# EasyEDA Pro project ProPrj_宠物喂养自动控制系统_2026-04-17.epro

# Schematic Schematic1
Assembly Variant: Basic; Board Name: Board1; Create Date: 2026-04-10; Page Name: P1; Project Name: 宠物喂养自动控制系统; Schematic Name: Schematic1; Update Date: 2026-04-10; BladeWidth: 10; Company: 嘉立创EDA; Page Size: A4; RegionStart: 1; ShowBorder: 1; TitleBlock: 1; TitleBlockPosition: 3; Version: V1.0; XRegionCount: 6; YRegionCount: 4
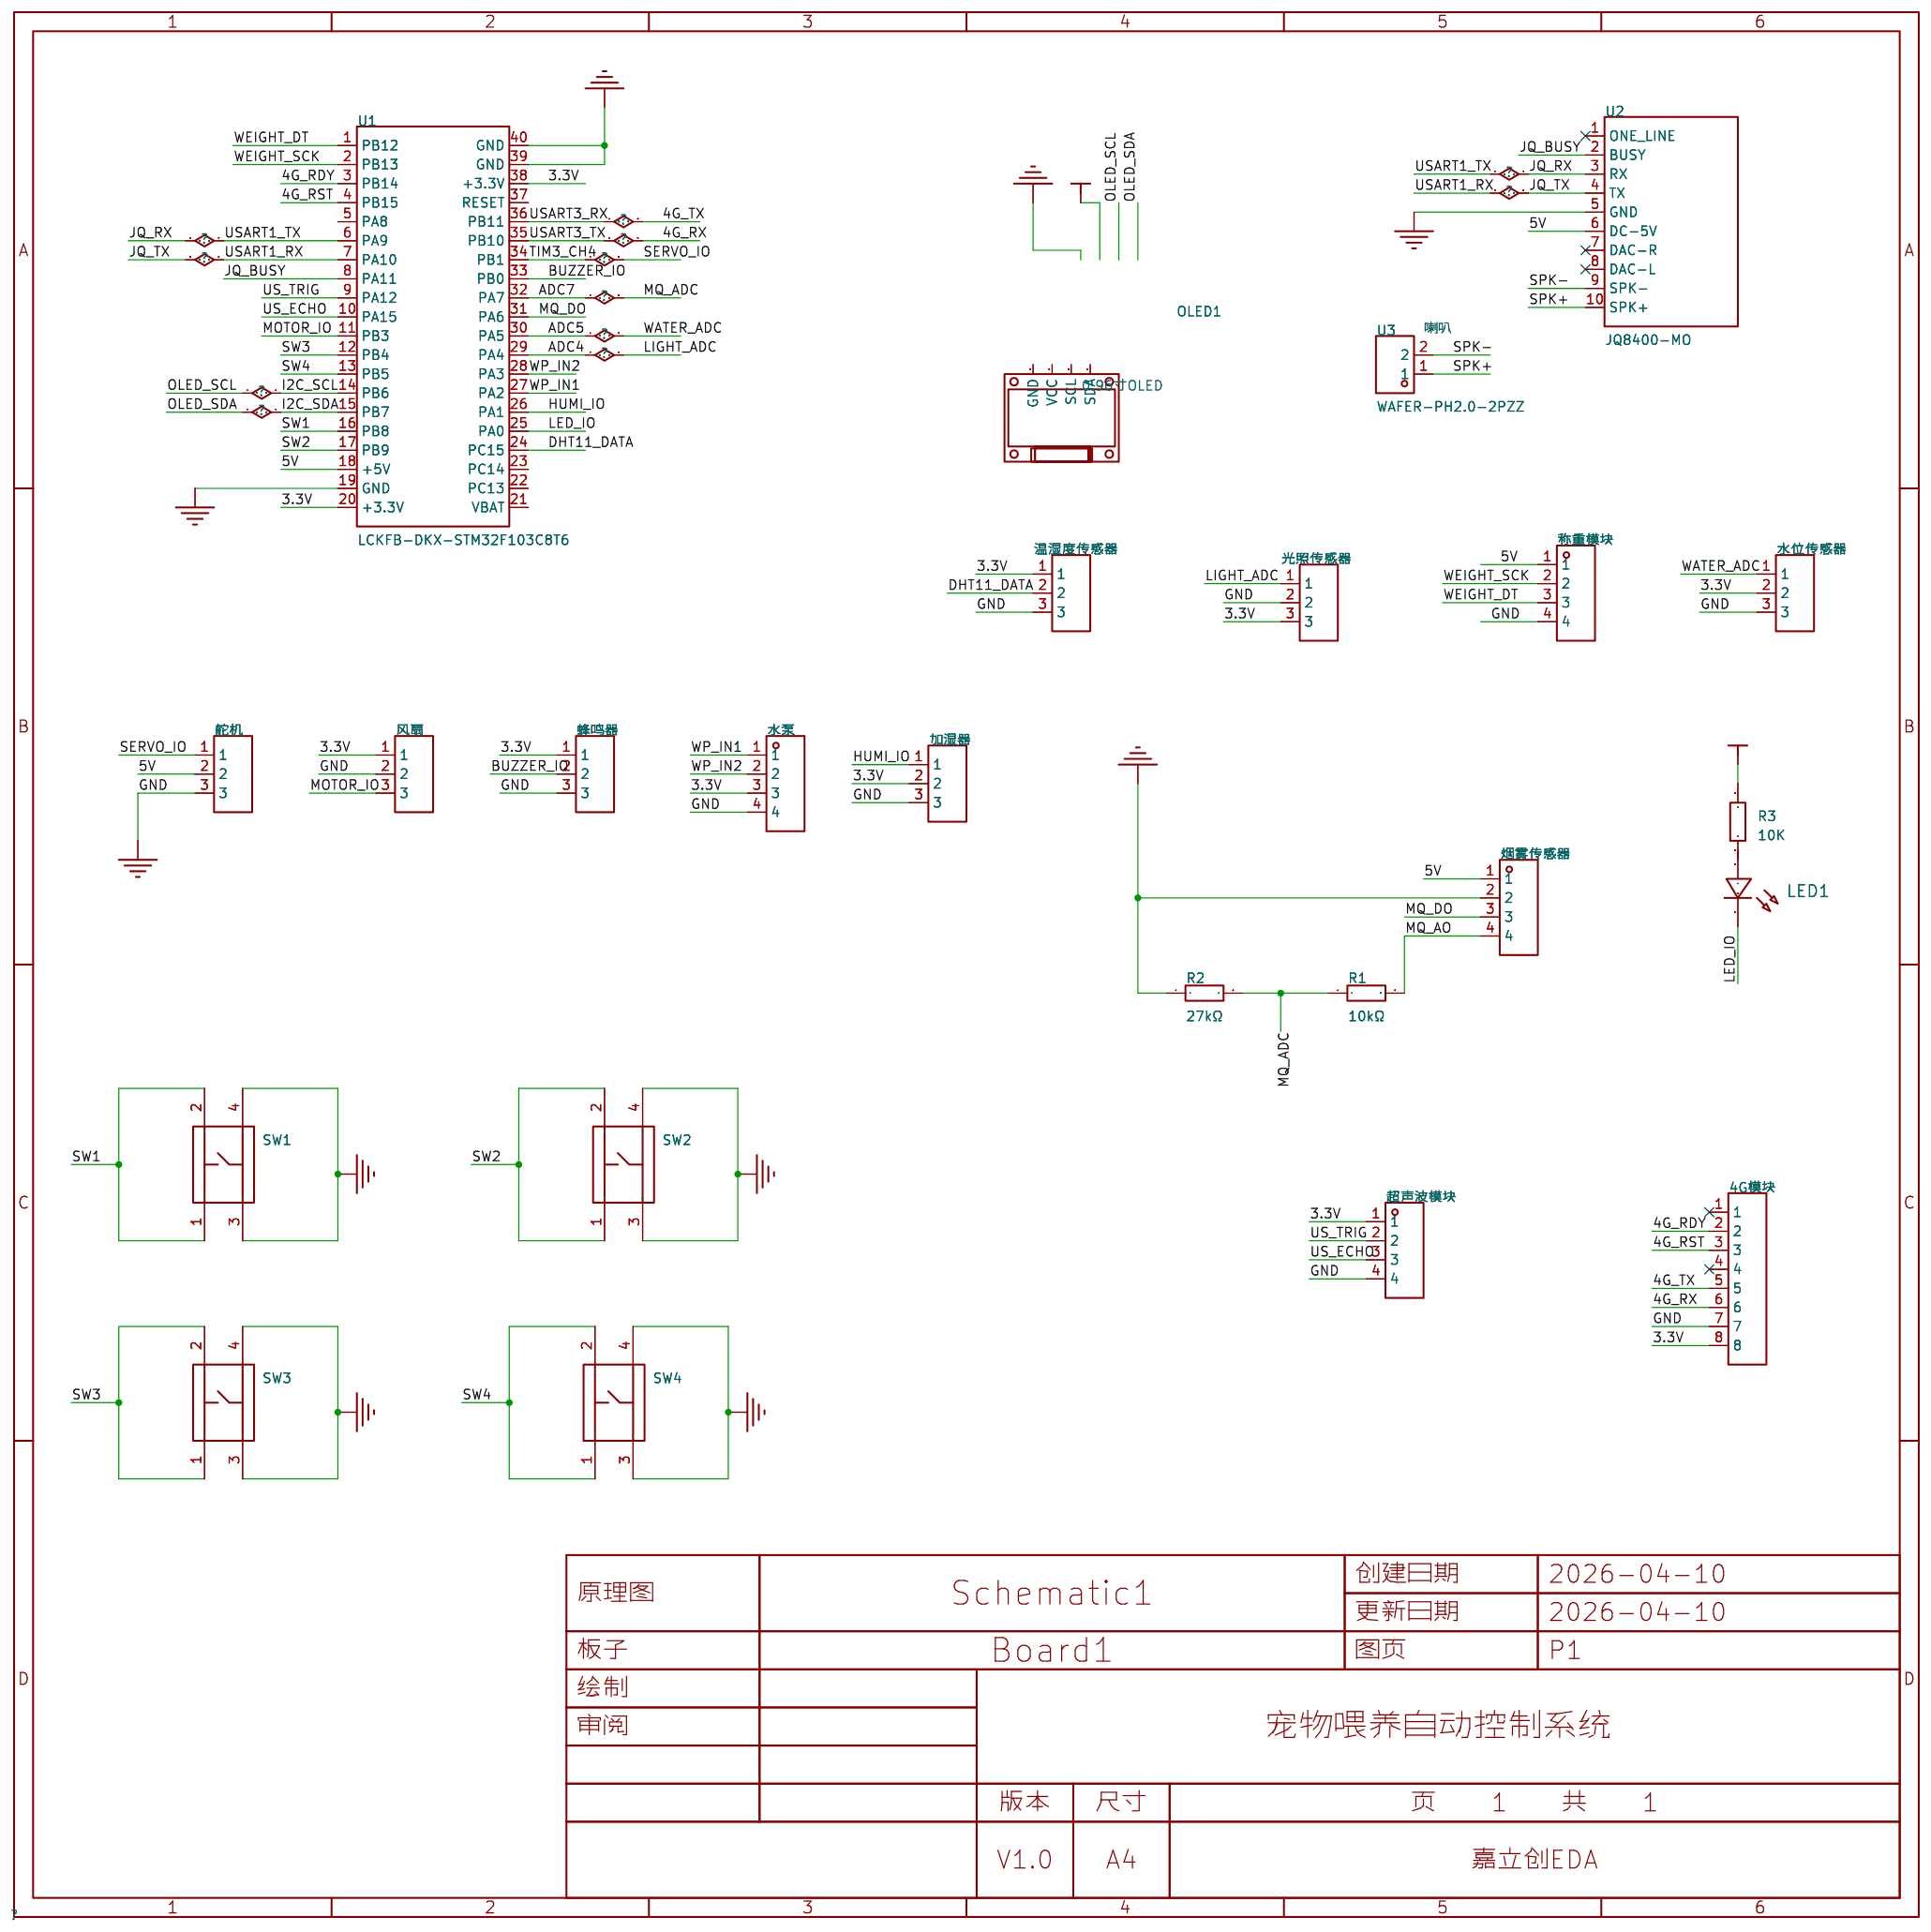
[diagram p0: schematic sheet]

## Parts
4G模块  -  [HDR-TH_8P-P2.54-V-F-1]
LED1  -  [LED_0805]
OLED1  -  [0.96OLED_4P]
R1  10kΩ  [R0805]
R2  27kΩ  [R0805]
R3  10K  [R0805]
SW1  K2-1102DP-C4SW-04  [KEY-TH_4P-L6.0-W6.0-P4.50-LS6.50]
SW2  K2-1102DP-C4SW-04  [KEY-TH_4P-L6.0-W6.0-P4.50-LS6.50]
SW3  K2-1102DP-C4SW-04  [KEY-TH_4P-L6.0-W6.0-P4.50-LS6.50]
SW4  K2-1102DP-C4SW-04  [KEY-TH_4P-L6.0-W6.0-P4.50-LS6.50]
U1  LCKFB-DKX-STM32F103C8T6  [CONN-TH_L53.3-W22.9_STM32F103C8T6-CARD]
U2  JQ8400-MO  [COMM-TH_JQ8400-FL]
U3  WAFER-PH2.0-2PZZ  [CONN-TH_2P-P2.00_HC-PH-2A-M]
光照传感器  PM254V-11-03-H85  [HDR-TH_3P-P2.54-V-F]
加湿器  -  [HDR-TH_3P-P2.54-V-F]
水位传感器  -  [HDR-TH_3P-P2.54-V-F]
水泵  -  [HDR-TH_4P-P2.54-V-F]
温湿度传感器  PM254V-11-03-H85  [HDR-TH_3P-P2.54-V-F]
烟雾传感器  -  [HDR-TH_4P-P2.54-V-F]
称重模块  -  [HDR-TH_4P-P2.54-V-F]
舵机  PM254V-11-03-H85  [HDR-TH_3P-P2.54-V-F]
蜂鸣器  -  [HDR-TH_3P-P2.54-V-F]
超声波模块  -  [HDR-TH_4P-P2.54-V-F]
风扇  -  [HDR-TH_3P-P2.54-V-F]

## Library data of the parts
4G模块 = HDR-F_2.54_1x8P: Supplier Part: C27438; Supplier Footprint: 插件
LED1 = LED_0805-R: Supplier Footprint: 0805
OLED1 = 0.96OLED模块_4P: Supplier Footprint: 插件
R1 R2 = 0805W8F1002T5E_C17414: 电阻类型:厚膜电阻;阻值:10kΩ;精度:±1%;功率:125mW;工作电压:150V;温度系数:±100ppm/℃;; LCSC Part Name: 10kΩ ±1% 125mW 厚膜电阻; Supplier Part: C17414; Manufacturer: UNI-ROYAL(厚声); Manufacturer Part: 0805W8F1002T5E; Supplier Footprint: 0805; JLCPCB Part Class: Basic Part; Datasheet: https://item.szlcsc.com/datasheet/0805W8F1002T5E/18102.html; Supplier: LCSC; Type: 厚膜电阻; Tolerance: ±1%; Power(Watts): 125mW; Voltage-Supply(Max): 150V; Temperature Coefficient: ±100ppm/℃; Operating Temperature: -55℃~+155℃
R3 = Res_0805: Supplier Footprint: 0805
SW1-SW4 = K2-1102DP-C4SW-04: 电路结构:单刀单掷;按钮形状:圆形按钮;作用力:2.5N;安装方式:直插;开关长度:6mm;开关宽度:6mm;开关高度:5mm;触点电流:50mA;额定电压:12V;带灯:-;工作寿命:10万次;; LCSC Part Name: 轻触按键开关6*6*5; Supplier Part: C110153; Manufacturer: 韩国韩荣; Supplier Footprint: 插件-4P,6x6mm; JLCPCB Part Class: Extended Part; Datasheet: https://item.szlcsc.com/datasheet/K2-1102DP-C4SW-04/111374.html; Supplier: LCSC; Circuit: 单刀单掷; Actuator Style: 圆形按钮; Operating Force: 2.5N; Mounting Type: 直插; Length: 6mm; Width: 6mm; Switch Height: 5mm; Contact Current: 50mA; Voltage Rating: 12V; Life: 10万次; Operating Temperature: -25℃~+85℃
U1 = LCKFB-DKX-STM32F103C8T6: 搭载Contex M3内核,程序存储容量64KB,RAM总容量20KB,最高72MHz主频,提供高效的计算能力和稳定的运行环境。; LCSC Part Name: 立创·地阔星-STM32F103C8T6开发板; Supplier Part: C22396880; Manufacturer: 立创开发板; JLCPCB Part Class: Extended Part; Datasheet: https://item.szlcsc.com/datasheet/LCKFB-DKX-STM32F103C8T6/24005615.html; Supplier: LCSC
U2 = JQ8400-MO: Supplier Part: C9900004523; Supplier Footprint: 插件; JLCPCB Part Class: Extended Part; Supplier: LCSC
U3 = WAFER-PH2.0-2PZZ: 插针结构:1x2P;间距:2mm;安装方式:直插;参考系列:PH;总PIN数:2P;排数:1;每排PIN数:2;行距:-;额定电流:2A;触头材质:黄铜;触头镀层:锡;工作温度:-25℃~+85℃;; LCSC Part Name: 1x2P 间距:2mm 直插 系列:PH; Supplier Part: C5359599; Manufacturer: XUNPU(讯普); Supplier Footprint: 插件,P=2mm; JLCPCB Part Class: Extended Part; Datasheet: https://atta.szlcsc.com/upload/public/pdf/source/20241108/09B74E94153224768C62B7F095CB8C18.pdf; Supplier: LCSC; Pins Structure: 1x2P; Pitch: 2mm; Mounting Type: 直插; Reference Series: PH; Number of Pins: 2P; Number of Rows: 1; Number of PINs Per Row: 2; Current Rating: 2A; Contact Material: 黄铜; Contact Plating: 锡; Operating Temperature: -25℃~+85℃; Voltage Rating: 250V; Plastic Material: PA66; Flame Retardant Rating: UL94V-0; Color: 白色; Z-Height of the Board: 6.05mm; X-Length of Bottom Edge on Board (Spacing Line): 6mm; Y-Width of Bottom Edge on Board: 4.7mm
光照传感器 温湿度传感器 舵机 = PM254V-11-03-H85: 插孔结构:1x3P;间距:2.54mm;行距:-;圆孔/方孔:方孔;安装方式:直插;排数:单排;总孔位数:3P;额定电流:3A;插孔方向:顶部;塑高:8.5mm;触头材质:黄铜;触头镀层:-;工作温度:-40℃~+105℃;; LCSC Part Name: 1x3P 间距:2.54mm 直插; Supplier Part: C541850; Manufacturer: XFCN(兴飞); Supplier Footprint: 插件,P=2.54mm; JLCPCB Part Class: Extended Part; Datasheet: https://item.szlcsc.com/datasheet/PM254V-11-03-H85/562471.html; Supplier: LCSC; Holes Structure: 1x3P; Pitch: 2.54mm; Circular Hole / Square Hole: 方孔; Mounting Type: 直插; Number of Rows: 单排; Number of Positions: 3P; Current Rating: 3A; Holes Direction: 顶部; Insulation Height: 8.5mm; Contact Material: 黄铜; Operating Temperature: -40℃~+105℃
加湿器 水位传感器 蜂鸣器 风扇 = HDR-F_2.54_1x3P: Supplier Part: C541850; Supplier Footprint: 插件
水泵 烟雾传感器 称重模块 超声波模块 = HDR-F_2.54_1x4P: Supplier Part: C2718488; Supplier Footprint: 插件

## Nets
3.3V: 4G模块.8 R3.2 U1.20(+3.3V) U1.38(+3.3V) 光照传感器.3 加湿器.2 水位传感器.2 水泵.3 温湿度传感器.1 蜂鸣器.1 超声波模块.1 风扇.1
5V: U1.18(+5V) U2.6(DC-5V) 烟雾传感器.1 称重模块.1 舵机.2
GND: 4G模块.7 R2.1 SW1.3 SW1.4 SW2.3 SW2.4 SW3.3 SW3.4 SW4.3 SW4.4 U1.19(GND) U1.39(GND) U1.40(GND) U2.5(GND) 光照传感器.2 加湿器.3 水位传感器.3 水泵.4 温湿度传感器.3 烟雾传感器.2 称重模块.4 舵机.3 蜂鸣器.3 超声波模块.4 风扇.2
4G_RDY: 4G模块.2 U1.3(PB14)
4G_RST: 4G模块.3 U1.4(PB15)
4G_RX: 4G模块.6 U1.35(PB10)
4G_TX: 4G模块.5 U1.36(PB11)
ADC4: U1.29(PA4) 光照传感器.1
ADC5: U1.30(PA5) 水位传感器.1
ADC7: R1.1 R2.2 U1.32(PA7)
BUZZER_IO: U1.33(PB0) 蜂鸣器.2
DHT11_DATA: U1.24(PC15) 温湿度传感器.2
HUMI_IO: U1.26(PA1) 加湿器.1
I2C_SCL: U1.14(PB6)
I2C_SDA: U1.15(PB7)
JQ_BUSY: U1.8(PA11) U2.2(BUSY)
JQ_RX: U1.6(PA9) U2.3(RX)
JQ_TX: U1.7(PA10) U2.4(TX)
LED_IO: LED1.1(C) U1.25(PA0)
MOTOR_IO: U1.11(PB3) 风扇.3
MQ_AO: R1.2 烟雾传感器.4
MQ_DO: U1.31(PA6) 烟雾传感器.3
SERVO_IO: U1.34(PB1) 舵机.1
SPK+: U2.10(SPK+) U3.1
SPK-: U2.9(SPK-) U3.2
SW1: SW1.1 SW1.2 U1.16(PB8)
SW2: SW2.1 SW2.2 U1.17(PB9)
SW3: SW3.1 SW3.2 U1.12(PB4)
SW4: SW4.1 SW4.2 U1.13(PB5)
US_ECHO: U1.10(PA15) 超声波模块.3
US_TRIG: U1.9(PA12) 超声波模块.2
WEIGHT_DT: U1.1(PB12) 称重模块.3
WEIGHT_SCK: U1.2(PB13) 称重模块.2
WP_IN1: U1.27(PA2) 水泵.1
WP_IN2: U1.28(PA3) 水泵.2
$1N171: LED1.2(A) R3.1

Not connected (* = marked no-connect by the designer): 4G模块 1* 4*; OLED1 1(GND) 2(VCC) 3(SCL) 4(SDA); U1 5(PA8) 21(VBAT) 22(PC13) 23(PC14) 37(RESET); U2 1(ONE_LINE)* 7(DAC-R)* 8(DAC-L)*

## Notes on the sheet
- 喇叭
- 0.96寸OLED

# Board PCB1
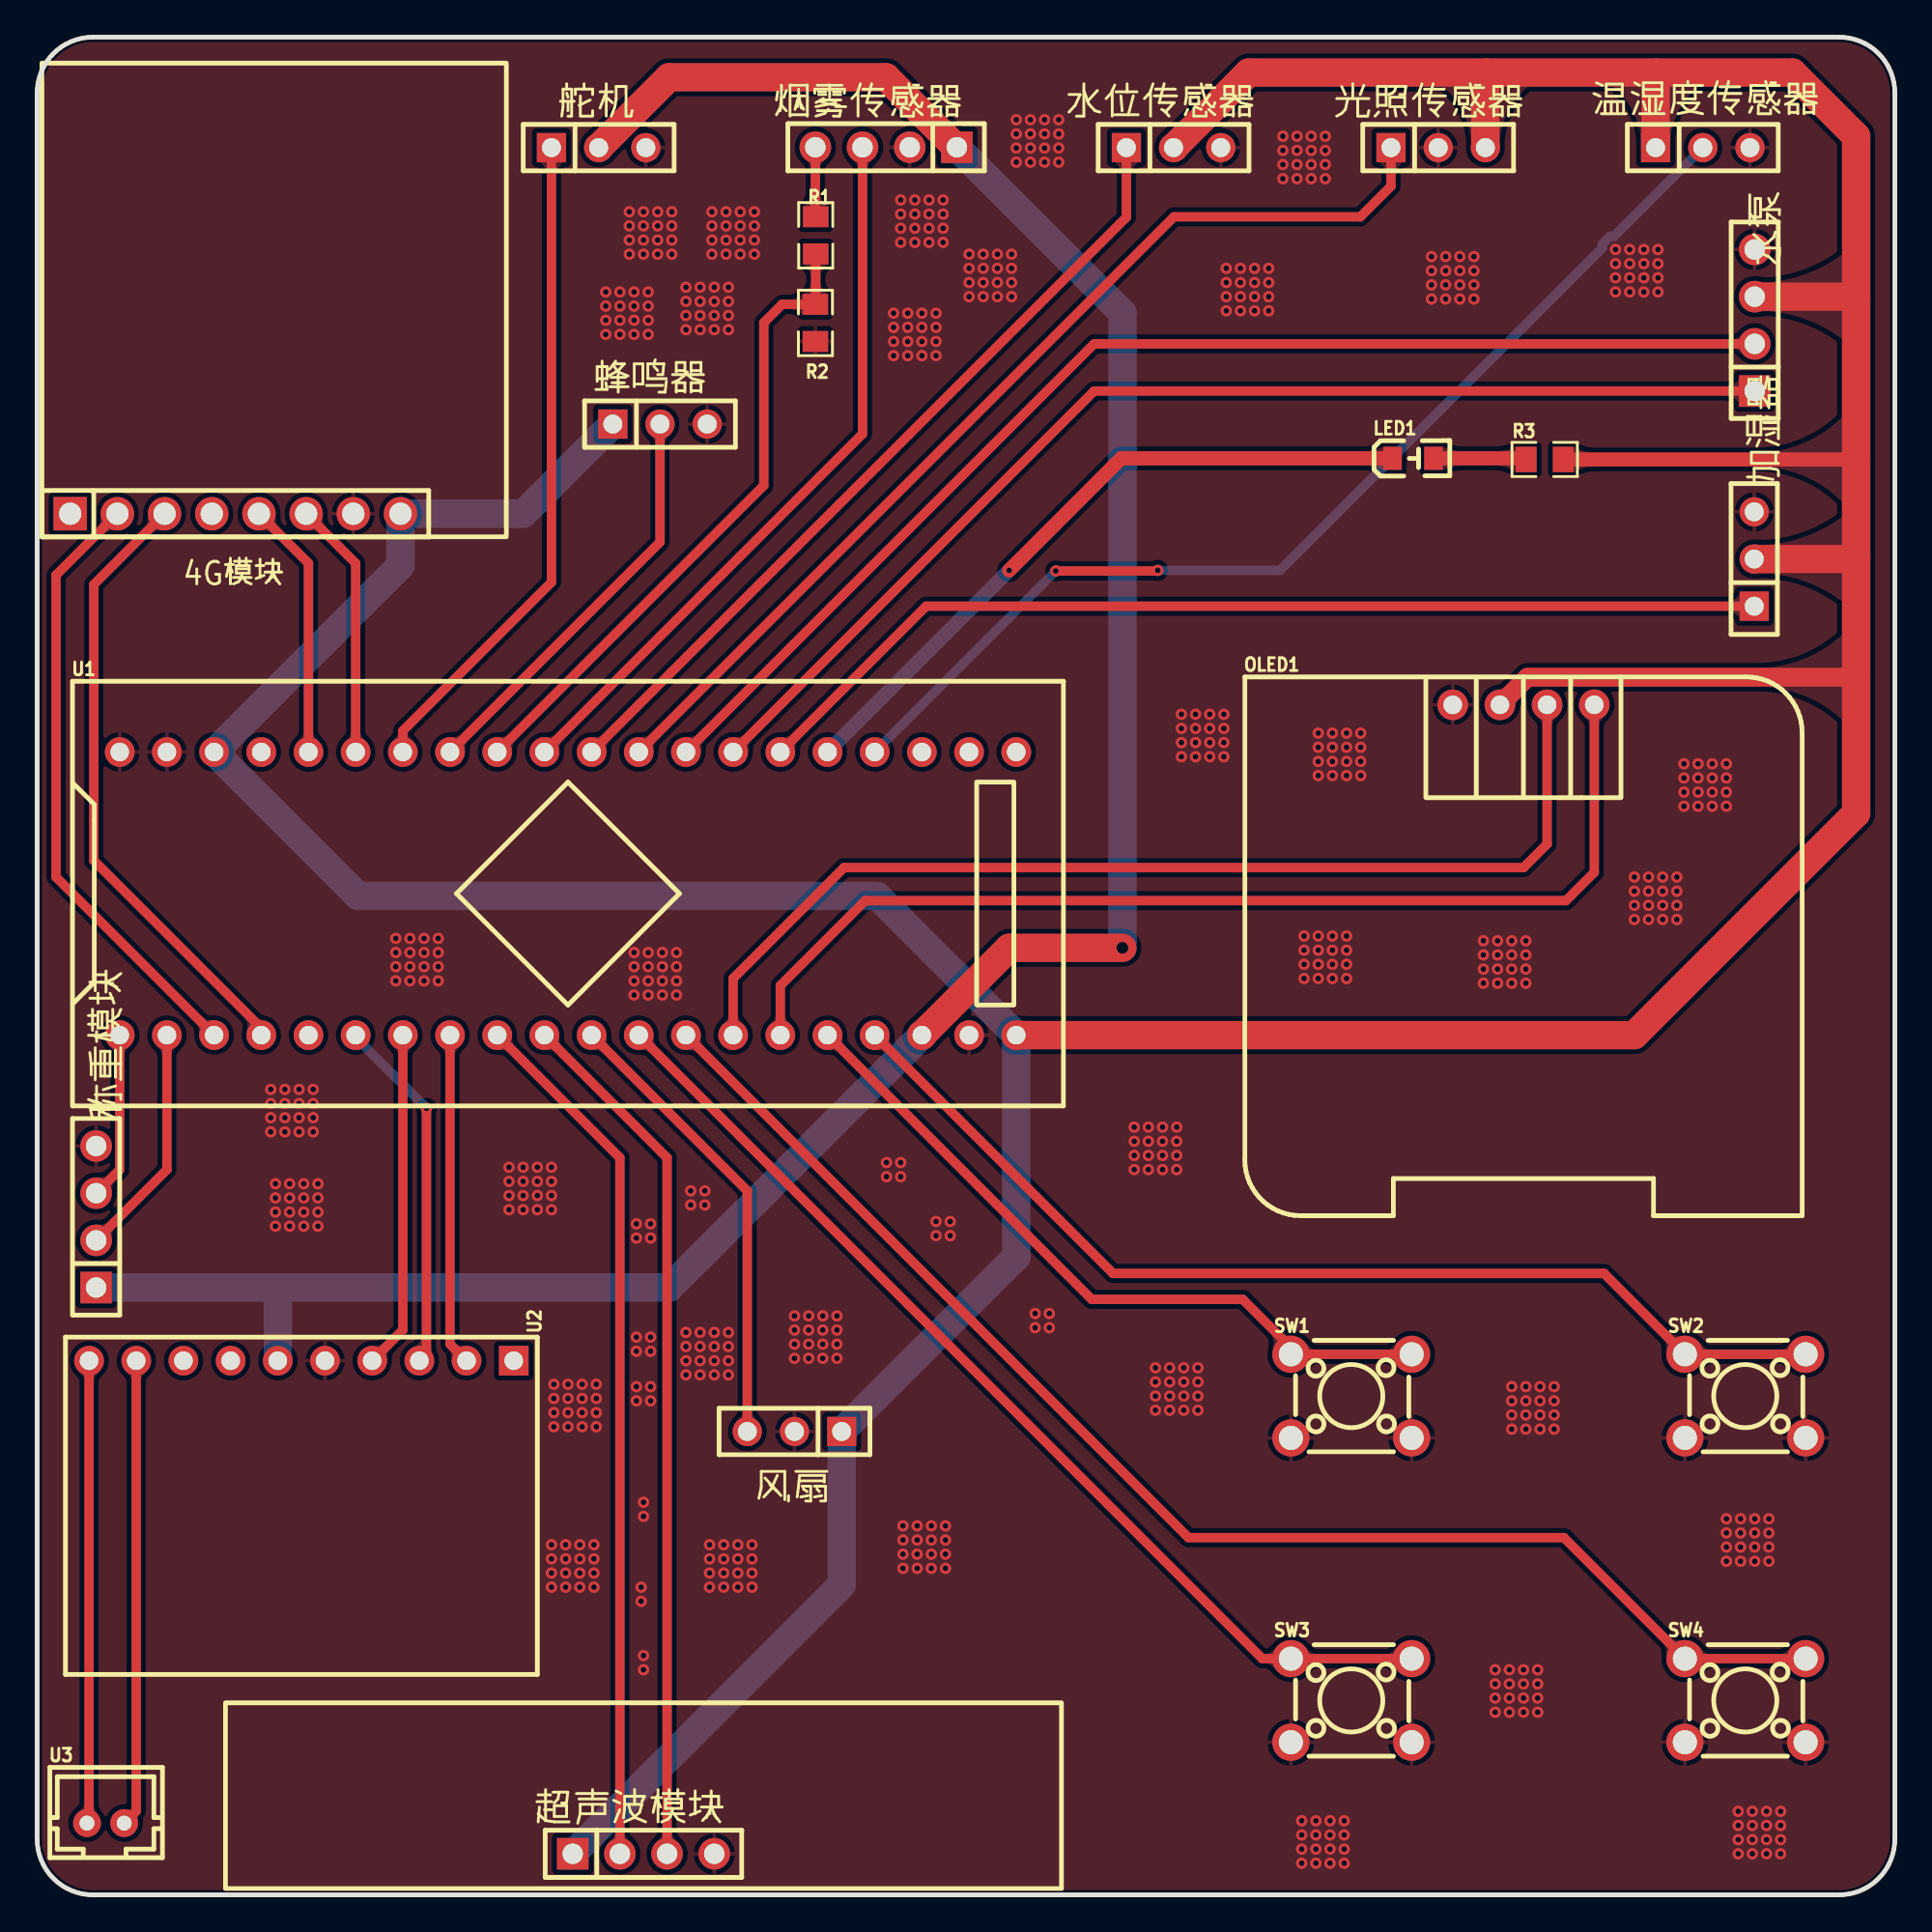
[diagram p1: board, top side]
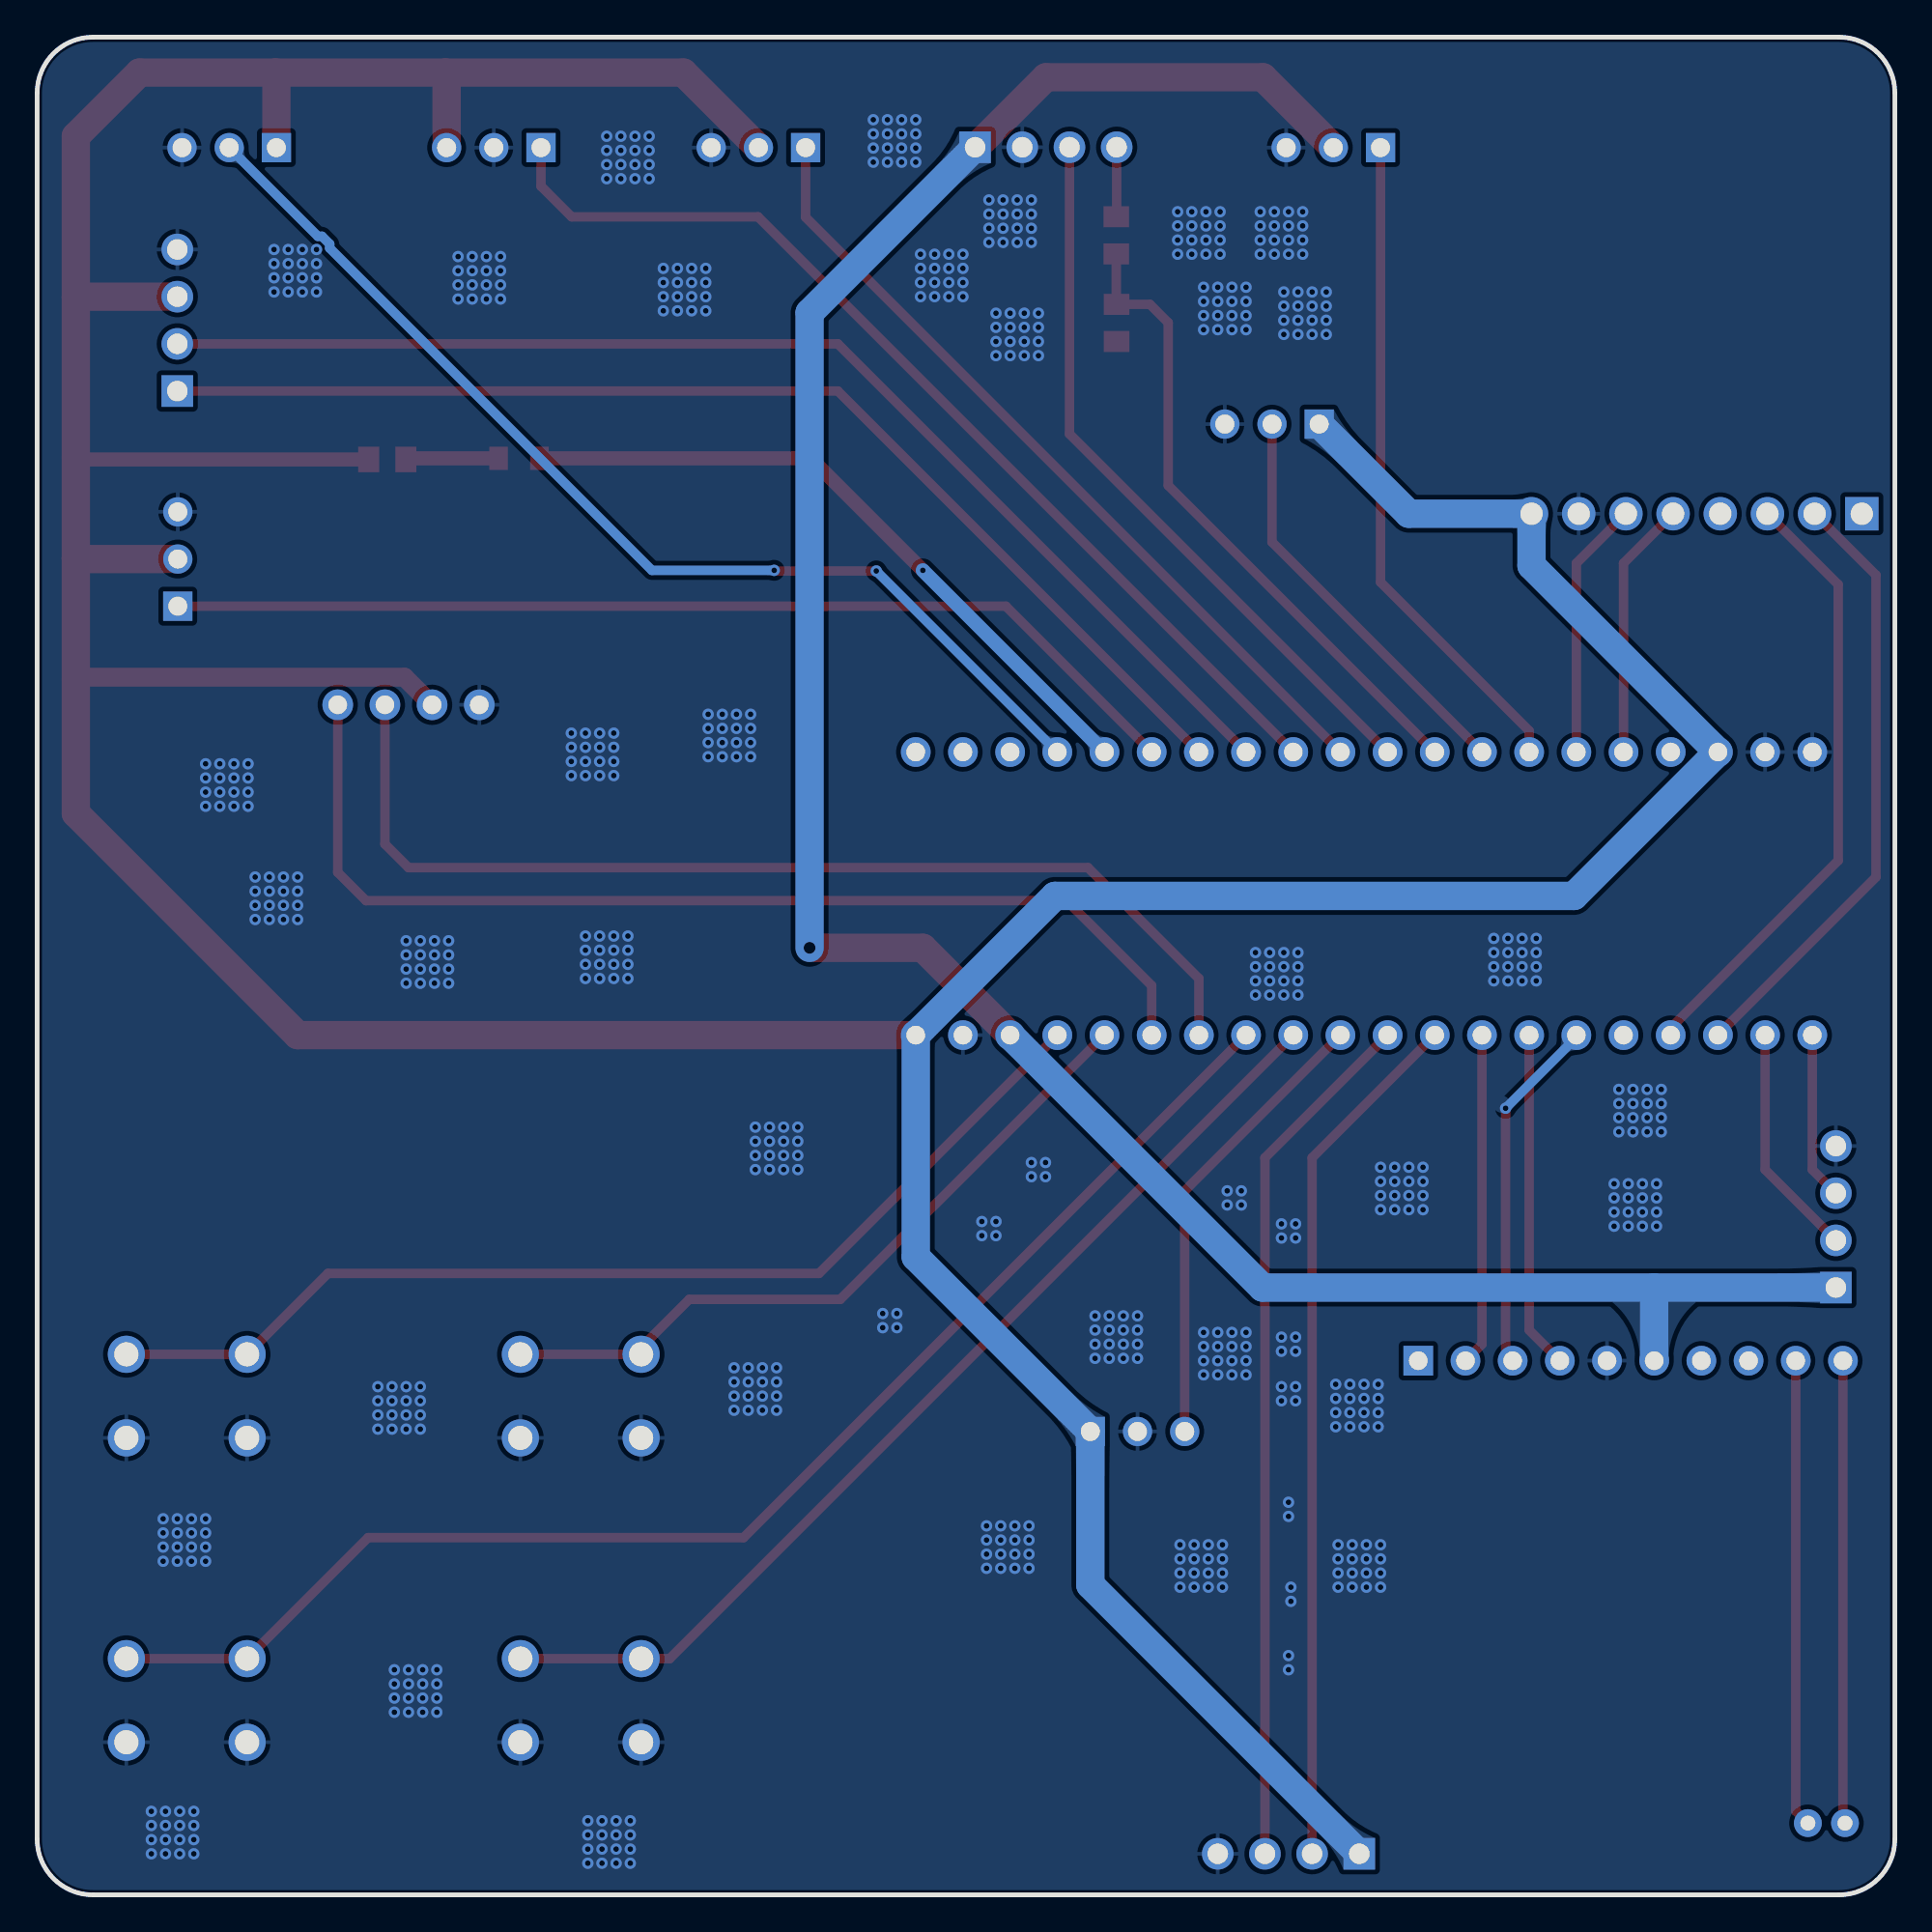
[diagram p2: board, bottom side, seen from below]

Outline 100 x 100 mm; copper layers: Top Layer, Bottom Layer. Coordinates in mm from the lower left corner of the outline.
Outline path: 0,97 0,3 arc(0.88,0.88) 3,0 97,0 arc(99.12,0.88) 100,3 100,97 arc(99.12,99.12) 97,100 3,100 arc(0.88,99.12) 0,97
Stack: Top Layer 0.035mm / Dielectric1 1.51mm FR4 er 4.5 / Bottom Layer 0.035mm

## Design rules (mm)
spacing copperThickness1oz (default): track to track 0.102, other pairs 0.152 to 0.3
spacing copperThickness2oz: track to track 0.203, other pairs 0.152 to 0.3
track width copperThickness1oz (default): min 0.127, default 0.254, max 2.54
track width copperThickness2oz: min 0.203, default 0.254, max 2.54
differential pair differentialPair (default): width min 0.127, default 0.254, max 2.54; gap min 0.152, default 0.152
net GND uses copperRegion

## Placement (name value [footprint] x y rotation side)
4G模块  -  [HDR-TH_8P-P2.54-V-F-1]  10.67 74.35 0 top
LED1  -  [LED_0805]  74.11 77.32 0 top
OLED1  -  [0.96OLED_4P]  80.01 64.06 0 top
R1  10kΩ  [R0805]  41.91 89.33 90 top
R2  27kΩ  [R0805]  41.89 84.62 90 top
R3  10K  [R0805]  81.15 77.27 0 top
SW1  K2-1102DP-C4SW-04  [KEY-TH_4P-L6.0-W6.0-P4.50-LS6.50]  70.74 26.85 0 top
SW2  K2-1102DP-C4SW-04  [KEY-TH_4P-L6.0-W6.0-P4.50-LS6.50]  91.95 26.85 0 top
SW3  K2-1102DP-C4SW-04  [KEY-TH_4P-L6.0-W6.0-P4.50-LS6.50]  70.74 10.47 0 top
SW4  K2-1102DP-C4SW-04  [KEY-TH_4P-L6.0-W6.0-P4.50-LS6.50]  91.95 10.47 0 top
U1  LCKFB-DKX-STM32F103C8T6  [CONN-TH_L53.3-W22.9_STM32F103C8T6-CARD]  28.57 53.9 0 top
U2  JQ8400-MO  [COMM-TH_JQ8400-FL]  14.22 28.75 270 top
U3  WAFER-PH2.0-2PZZ  [CONN-TH_2P-P2.00_HC-PH-2A-M]  3.68 3.86 0 top
光照传感器  PM254V-11-03-H85  [HDR-TH_3P-P2.54-V-F]  75.42 94.05 0 top
加湿器  -  [HDR-TH_3P-P2.54-V-F]  92.43 71.91 90 top
水位传感器  -  [HDR-TH_3P-P2.54-V-F]  61.17 94.05 0 top
水泵  -  [HDR-TH_4P-P2.54-V-F]  92.46 84.76 90 top
温湿度传感器  PM254V-11-03-H85  [HDR-TH_3P-P2.54-V-F]  89.66 94.05 0 top
烟雾传感器  -  [HDR-TH_4P-P2.54-V-F]  45.7 94.07 180 top
称重模块  -  [HDR-TH_4P-P2.54-V-F]  3.17 36.5 90 top
舵机  PM254V-11-03-H85  [HDR-TH_3P-P2.54-V-F]  30.23 94.05 0 top
蜂鸣器  -  [HDR-TH_3P-P2.54-V-F]  33.53 79.17 0 top
超声波模块  -  [HDR-TH_4P-P2.54-V-F]  32.64 2.21 0 top
风扇  -  [HDR-TH_3P-P2.54-V-F]  40.77 24.94 180 top

## Footprints (pads in the part's own frame, mm; a bottom-side part is the same pattern mirrored in y, then rotated)
0.96OLED_4P
  round 1.65 hole 1: 1(-3.81,-0.002) 2(-1.27,0.002) 3(1.27,0.002) 4(3.81,0.002)
COMM-TH_JQ8400-FL
  rect 1.6x1.6 hole 1: 1(0,11.43)
  round 1.6 hole 1: 2(0,8.89) 3(0,6.35) 4(0,3.81) 5(0,1.27) 6(0,-1.27) 7(0,-3.81) 8(0,-6.35) 9(0,-8.89) 10(0,-11.43)
CONN-TH_2P-P2.00_HC-PH-2A-M
  round 1.5 hole 0.8: 1(-1,0) 2(1,0)
CONN-TH_L53.3-W22.9_STM32F103C8T6-CARD
  round 1.6 hole 1: 1(-24.13,-7.62) 2(-21.59,-7.62) 3(-19.05,-7.62) 4(-16.51,-7.62) 5(-13.97,-7.62) 6(-11.43,-7.62) 7(-8.89,-7.62) 8(-6.35,-7.62) 9(-3.81,-7.62) 10(-1.27,-7.62) 11(1.27,-7.62) 12(3.81,-7.62) 13(6.35,-7.62) 14(8.89,-7.62) 15(11.43,-7.62) 16(13.97,-7.62) 17(16.51,-7.62) 18(19.05,-7.62) 19(21.59,-7.62) 20(24.13,-7.62) 21(24.13,7.62) 22(21.59,7.62) 23(19.05,7.62) 24(16.51,7.62) 25(13.97,7.62) 26(11.43,7.62) 27(8.89,7.62) 28(6.35,7.62) 29(3.81,7.62) 30(1.27,7.62) 31(-1.27,7.62) 32(-3.81,7.62) 33(-6.35,7.62) 34(-8.89,7.62) 35(-11.43,7.62) 36(-13.97,7.62) 37(-16.51,7.62) 38(-19.05,7.62) 39(-21.59,7.62) 40(-24.13,7.62)
HDR-TH_3P-P2.54-V-F
  rect 1.575x1.575 hole 1.02: 1(-2.54,0)
  round 1.575 hole 1.02: 2(0,0) 3(2.54,0)
HDR-TH_4P-P2.54-V-F
  rect 1.7x1.7 hole 1.1: 1(-3.81,0)
  round 1.7 hole 1.1: 2(-1.27,0) 3(1.27,0) 4(3.81,0)
HDR-TH_8P-P2.54-V-F-1
  rect 1.8x1.8 hole 1.2: 1(-8.89,0)
  round 1.8 hole 1.2: 2(-6.35,0) 3(-3.81,0) 4(-1.27,0) 5(1.27,0) 6(3.81,0) 7(6.35,0) 8(8.89,0)
KEY-TH_4P-L6.0-W6.0-P4.50-LS6.50
  round 2 hole 1.3: 1(-3.25,2.25) 2(3.25,2.25) 3(-3.25,-2.25) 4(3.25,-2.25)
LED_0805
  rect 1x1.25 smd: 1(-1.15,0.005) 2(1.05,0.005)
R0805
  rect 1.133x1.377 smd: 1(-1,0) 2(1,0)

## Nets
As in the schematic, except:
3.3V: 4G模块.8 OLED1.2 R3.2 U1.20 U1.38 光照传感器.3 加湿器.2 水位传感器.2 水泵.3 温湿度传感器.1 蜂鸣器.1 超声波模块.1 风扇.1
GND: 4G模块.7 OLED1.1 R2.1 SW1.3 SW1.4 SW2.3 SW2.4 SW3.3 SW3.4 SW4.3 SW4.4 U1.19 U1.39 U1.40 U2.5 光照传感器.2 加湿器.3 水位传感器.3 水泵.4 温湿度传感器.3 烟雾传感器.2 称重模块.4 舵机.3 蜂鸣器.3 超声波模块.4 风扇.2
I2C_SCL: OLED1.3 U1.14
I2C_SDA: OLED1.4 U1.15

Pads without a net: 4G模块 1 4; U1 5 21 22 23 37; U2 1 7 8

## Via types
v1: diameter 0.61, hole 0.305, Top Layer to Bottom Layer, 614 vias
v2: diameter 1.27, hole 0.635, Top Layer to Bottom Layer, 1 via

## Routing (per net, layer and track width the routed paths; a pad name or vN(x,y) marks a point on that pad's centre or on a via; arc(x,y) is an arc through that point)
3.3V: length 315.1
  Top Layer w0.762: R3.2 97.8,77.27 97.92,77.38
  Top Layer w1.016: OLED1.2 80.22,65.55 97.8,65.55 97.92,65.43
  Top Layer w1.524: 97.92,71.95 97.92,58.22 85.98,46.28 U1.20 ; 97.92,71.95 97.92,85.99 ; 97.92,71.95 97.87,71.91 加湿器.2 ; 78.02,98.09 77.96,98.03 光照传感器.3 ; 78.02,98.09 87.16,98.09 ; 78.02,98.09 65.22,98.09 水位传感器.2 ; 87.16,98.09 94.49,98.09 97.92,94.67 97.92,85.99 ; 87.16,98.09 87.12,98.06 温湿度传感器.1 ; 水泵.3 97.88,86.03 97.92,85.99
  Bottom Layer w1.524: 蜂鸣器.1 26.16,74.35 4G模块.8 19.56,71.55 U1.38 17.27,53.77 45.21,53.77 U1.20 52.71,34.34 风扇.1 43.31,16.69 超声波模块.1
5V: length 136
  Top Layer w1.524: 烟雾传感器.1 49.46,94.07 45.7,97.84 34.01,97.84 舵机.2 ; U1.18 52.32,50.98 v2(58.42,50.98)
  Bottom Layer w1.524: 12.97,32.69 34.04,32.69 U1.18 ; 12.97,32.69 称重模块.1 ; 12.97,32.69 12.95,32.67 U2.6 ; v2(58.42,50.98) 58.42,85.16 烟雾传感器.1
GND:
  vias: v1(12.57,43.36) v1(12.57,42.6) v1(12.57,41.83) v1(12.57,41.07) v1(12.83,38.28) v1(12.83,37.52) v1(12.83,36.75) v1(12.83,35.99) v1(13.33,43.36) v1(13.33,42.6) v1(13.33,41.83) v1(13.33,41.07) v1(13.59,38.28) v1(13.59,37.52) v1(13.59,36.75) v1(13.59,35.99) v1(14.1,43.36) v1(14.1,42.6) v1(14.1,41.83) v1(14.1,41.07) v1(14.35,38.28) v1(14.35,37.52) v1(14.35,36.75) v1(14.35,35.99) v1(14.86,43.36) v1(14.86,42.6) v1(14.86,41.83) v1(14.86,41.07) v1(15.11,38.28) v1(15.11,37.52) v1(15.11,36.75) v1(15.11,35.99) v1(19.3,51.49) v1(19.3,50.72) v1(19.3,49.96) v1(19.3,49.2) v1(20.07,51.49) v1(20.07,50.72) v1(20.07,49.96) v1(20.07,49.2) v1(20.83,51.49) v1(20.83,50.72) v1(20.83,49.96) v1(20.83,49.2) v1(21.59,51.49) v1(21.59,50.72) v1(21.59,49.96) v1(21.59,49.2) v1(25.4,39.17) v1(25.4,38.41) v1(25.4,37.64) v1(25.4,36.88) v1(26.16,39.17) v1(26.16,38.41) v1(26.16,37.64) v1(26.16,36.88) v1(26.92,39.17) v1(26.92,38.41) v1(26.92,37.64) v1(26.92,36.88) v1(27.69,39.17) v1(27.69,38.41) v1(27.69,37.64) v1(27.69,36.88) v1(27.69,18.85) v1(27.69,18.09) v1(27.69,17.32) v1(27.69,16.56) v1(27.81,27.48) v1(27.81,26.72) v1(27.81,25.96) v1(27.81,25.2) v1(28.45,18.85) v1(28.45,18.09) v1(28.45,17.32) v1(28.45,16.56) v1(28.57,27.48) v1(28.57,26.72) v1(28.57,25.96) v1(28.57,25.2) v1(29.21,18.85) v1(29.21,18.09) v1(29.21,17.32) v1(29.21,16.56) v1(29.34,27.48) v1(29.34,26.72) v1(29.34,25.96) v1(29.34,25.2) v1(29.97,18.85) v1(29.97,18.09) v1(29.97,17.32) v1(29.97,16.56) v1(30.1,27.48) v1(30.1,26.72) v1(30.1,25.96) v1(30.1,25.2) v1(30.61,86.28) v1(30.61,85.52) v1(30.61,84.76) v1(30.61,84) v1(31.37,86.28) v1(31.37,85.52) v1(31.37,84.76) v1(31.37,84) v1(31.88,90.6) v1(31.88,89.84) v1(31.88,89.08) v1(31.88,88.32) v1(32.13,86.28) v1(32.13,85.52) v1(32.13,84.76) v1(32.13,84) v1(32.13,50.72) v1(32.13,49.96) v1(32.13,49.2) v1(32.13,48.44) v1(32.26,36.12) v1(32.26,35.36) v1(32.26,30.02) v1(32.26,29.26) v1(32.26,27.36) v1(32.26,26.59) v1(32.51,16.56) v1(32.51,15.8) v1(32.64,90.6) v1(32.64,89.84) v1(32.64,89.08) v1(32.64,88.32) v1(32.64,21.13) v1(32.64,20.37) v1(32.64,12.88) v1(32.64,12.12) v1(32.89,86.28) v1(32.89,85.52) v1(32.89,84.76) v1(32.89,84) v1(32.89,50.72) v1(32.89,49.96) v1(32.89,49.2) v1(32.89,48.44) v1(33.02,36.12) v1(33.02,35.36) v1(33.02,30.02) v1(33.02,29.26) v1(33.02,27.36) v1(33.02,26.59) v1(33.4,90.6) v1(33.4,89.84) v1(33.4,89.08) v1(33.4,88.32) v1(33.66,50.72) v1(33.66,49.96) v1(33.66,49.2) v1(33.66,48.44) v1(34.16,90.6) v1(34.16,89.84) v1(34.16,89.08) v1(34.16,88.32) v1(34.42,50.72) v1(34.42,49.96) v1(34.42,49.2) v1(34.42,48.44) v1(34.93,86.54) v1(34.93,85.78) v1(34.93,85.01) v1(34.93,84.25) v1(34.93,30.28) v1(34.93,29.51) v1(34.93,28.75) v1(34.93,27.99) v1(35.18,37.9) v1(35.18,37.14) v1(35.69,86.54) v1(35.69,85.78) v1(35.69,85.01) v1(35.69,84.25) v1(35.69,30.28) v1(35.69,29.51) v1(35.69,28.75) v1(35.69,27.99) v1(35.94,37.9) v1(35.94,37.14) v1(36.19,18.85) v1(36.19,18.09) v1(36.19,17.32) v1(36.19,16.56) v1(36.32,90.6) v1(36.32,89.84) v1(36.32,89.08) v1(36.32,88.32) v1(36.45,86.54) v1(36.45,85.78) v1(36.45,85.01) v1(36.45,84.25) v1(36.45,30.28) v1(36.45,29.51) v1(36.45,28.75) v1(36.45,27.99) v1(36.96,18.85) v1(36.96,18.09) v1(36.96,17.32) v1(36.96,16.56) v1(37.08,90.6) v1(37.08,89.84) v1(37.08,89.08) v1(37.08,88.32) v1(37.21,86.54) v1(37.21,85.78) v1(37.21,85.01) v1(37.21,84.25) v1(37.21,30.28) v1(37.21,29.51) v1(37.21,28.75) v1(37.21,27.99) v1(37.72,18.85) v1(37.72,18.09) v1(37.72,17.32) v1(37.72,16.56) v1(37.85,90.6) v1(37.85,89.84) v1(37.85,89.08) v1(37.85,88.32) v1(38.48,18.85) v1(38.48,18.09) v1(38.48,17.32) v1(38.48,16.56) v1(38.61,90.6) v1(38.61,89.84) v1(38.61,89.08) v1(38.61,88.32) v1(40.77,31.17) v1(40.77,30.4) v1(40.77,29.64) v1(40.77,28.88) v1(41.53,31.17) v1(41.53,30.4) v1(41.53,29.64) v1(41.53,28.88) v1(42.29,31.17) v1(42.29,30.4) v1(42.29,29.64) v1(42.29,28.88) v1(43.05,31.17) v1(43.05,30.4) v1(43.05,29.64) v1(43.05,28.88) v1(45.72,39.42) v1(45.72,38.66) v1(46.1,85.14) v1(46.1,84.38) v1(46.1,83.62) v1(46.1,82.86) v1(46.48,91.24) v1(46.48,90.47) v1(46.48,89.71) v1(46.48,88.95) v1(46.48,39.42) v1(46.48,38.66) v1(46.61,19.86) v1(46.61,19.1) v1(46.61,18.34) v1(46.61,17.58) v1(46.86,85.14) v1(46.86,84.38) v1(46.86,83.62) v1(46.86,82.86) v1(47.24,91.24) v1(47.24,90.47) v1(47.24,89.71) v1(47.24,88.95) v1(47.37,19.86) v1(47.37,19.1) v1(47.37,18.34) v1(47.37,17.58) v1(47.62,85.14) v1(47.62,84.38) v1(47.62,83.62) v1(47.62,82.86) v1(48.01,91.24) v1(48.01,90.47) v1(48.01,89.71) v1(48.01,88.95) v1(48.13,19.86) v1(48.13,19.1) v1(48.13,18.34) v1(48.13,17.58) v1(48.39,85.14) v1(48.39,84.38) v1(48.39,83.62) v1(48.39,82.86) v1(48.39,36.25) v1(48.39,35.48) v1(48.77,91.24) v1(48.77,90.47) v1(48.77,89.71) v1(48.77,88.95) v1(48.9,19.86) v1(48.9,19.1) v1(48.9,18.34) v1(48.9,17.58) v1(49.15,36.25) v1(49.15,35.48) v1(50.16,88.32) v1(50.16,87.55) v1(50.16,86.79) v1(50.16,86.03) v1(50.93,88.32) v1(50.93,87.55) v1(50.93,86.79) v1(50.93,86.03) v1(51.69,88.32) v1(51.69,87.55) v1(51.69,86.79) v1(51.69,86.03) v1(52.45,88.32) v1(52.45,87.55) v1(52.45,86.79) v1(52.45,86.03) v1(52.71,95.56) v1(52.71,94.79) v1(52.71,94.03) v1(52.71,93.27) v1(53.47,95.56) v1(53.47,94.79) v1(53.47,94.03) v1(53.47,93.27) v1(53.72,31.29) v1(53.72,30.53) v1(54.23,95.56) v1(54.23,94.79) v1(54.23,94.03) v1(54.23,93.27) v1(54.48,31.29) v1(54.48,30.53) v1(54.99,95.56) v1(54.99,94.79) v1(54.99,94.03) v1(54.99,93.27) v1(59.06,41.33) v1(59.06,40.56) v1(59.06,39.8) v1(59.06,39.04) v1(59.82,41.33) v1(59.82,40.56) v1(59.82,39.8) v1(59.82,39.04) v1(60.2,28.37) v1(60.2,27.61) v1(60.2,26.85) v1(60.2,26.09) v1(60.58,41.33) v1(60.58,40.56) v1(60.58,39.8) v1(60.58,39.04) v1(60.96,28.37) v1(60.96,27.61) v1(60.96,26.85) v1(60.96,26.09) v1(61.34,41.33) v1(61.34,40.56) v1(61.34,39.8) v1(61.34,39.04) v1(61.59,63.55) v1(61.59,62.79) v1(61.59,62.03) v1(61.59,61.27) v1(61.72,28.37) v1(61.72,27.61) v1(61.72,26.85) v1(61.72,26.09) v1(62.36,63.55) v1(62.36,62.79) v1(62.36,62.03) v1(62.36,61.27) v1(62.48,28.37) v1(62.48,27.61) v1(62.48,26.85) v1(62.48,26.09) v1(63.12,63.55) v1(63.12,62.79) v1(63.12,62.03) v1(63.12,61.27) v1(63.88,63.55) v1(63.88,62.79) v1(63.88,62.03) v1(63.88,61.27) v1(64.01,87.55) v1(64.01,86.79) v1(64.01,86.03) v1(64.01,85.27) v1(64.77,87.55) v1(64.77,86.79) v1(64.77,86.03) v1(64.77,85.27) v1(65.53,87.55) v1(65.53,86.79) v1(65.53,86.03) v1(65.53,85.27) v1(66.29,87.55) v1(66.29,86.79) v1(66.29,86.03) v1(66.29,85.27) v1(67.06,94.67) v1(67.06,93.9) v1(67.06,93.14) v1(67.06,92.38) v1(67.82,94.67) v1(67.82,93.9) v1(67.82,93.14) v1(67.82,92.38) v1(68.07,3.99) v1(68.07,3.23) v1(68.07,2.46) v1(68.07,1.7) v1(68.2,51.61) v1(68.2,50.85) v1(68.2,50.09) v1(68.2,49.33) v1(68.58,94.67) v1(68.58,93.9) v1(68.58,93.14) v1(68.58,92.38) v1(68.83,3.99) v1(68.83,3.23) v1(68.83,2.46) v1(68.83,1.7) v1(68.96,62.53) v1(68.96,61.77) v1(68.96,61.01) v1(68.96,60.25) v1(68.96,51.61) v1(68.96,50.85) v1(68.96,50.09) v1(68.96,49.33) v1(69.34,94.67) v1(69.34,93.9) v1(69.34,93.14) v1(69.34,92.38) v1(69.6,3.99) v1(69.6,3.23) v1(69.6,2.46) v1(69.6,1.7) v1(69.72,62.53) v1(69.72,61.77) v1(69.72,61.01) v1(69.72,60.25) v1(69.72,51.61) v1(69.72,50.85) v1(69.72,50.09) v1(69.72,49.33) v1(70.36,3.99) v1(70.36,3.23) v1(70.36,2.46) v1(70.36,1.7) v1(70.49,62.53) v1(70.49,61.77) v1(70.49,61.01) v1(70.49,60.25) v1(70.49,51.61) v1(70.49,50.85) v1(70.49,50.09) v1(70.49,49.33) v1(71.25,62.53) v1(71.25,61.77) v1(71.25,61.01) v1(71.25,60.25) v1(75.06,88.19) v1(75.06,87.43) v1(75.06,86.67) v1(75.06,85.9) v1(75.82,88.19) v1(75.82,87.43) v1(75.82,86.67) v1(75.82,85.9) v1(76.58,88.19) v1(76.58,87.43) v1(76.58,86.67) v1(76.58,85.9) v1(77.34,88.19) v1(77.34,87.43) v1(77.34,86.67) v1(77.34,85.9) v1(77.85,51.36) v1(77.85,50.6) v1(77.85,49.83) v1(77.85,49.07) v1(78.49,12.12) v1(78.49,11.35) v1(78.49,10.59) v1(78.49,9.83) v1(78.61,51.36) v1(78.61,50.6) v1(78.61,49.83) v1(78.61,49.07) v1(79.25,12.12) v1(79.25,11.35) v1(79.25,10.59) v1(79.25,9.83) v1(79.38,51.36) v1(79.38,50.6) v1(79.38,49.83) v1(79.38,49.07) v1(79.38,27.36) v1(79.38,26.59) v1(79.38,25.83) v1(79.38,25.07) v1(80.01,12.12) v1(80.01,11.35) v1(80.01,10.59) v1(80.01,9.83) v1(80.14,51.36) v1(80.14,50.6) v1(80.14,49.83) v1(80.14,49.07) v1(80.14,27.36) v1(80.14,26.59) v1(80.14,25.83) v1(80.14,25.07) v1(80.77,12.12) v1(80.77,11.35) v1(80.77,10.59) v1(80.77,9.83) v1(80.9,27.36) v1(80.9,26.59) v1(80.9,25.83) v1(80.9,25.07) v1(81.66,27.36) v1(81.66,26.59) v1(81.66,25.83) v1(81.66,25.07) v1(84.96,88.57) v1(84.96,87.81) v1(84.96,87.05) v1(84.96,86.28) v1(85.72,88.57) v1(85.72,87.81) v1(85.72,87.05) v1(85.72,86.28) v1(85.98,54.79) v1(85.98,54.03) v1(85.98,53.26) v1(85.98,52.5) v1(86.49,88.57) v1(86.49,87.81) v1(86.49,87.05) v1(86.49,86.28) v1(86.74,54.79) v1(86.74,54.03) v1(86.74,53.26) v1(86.74,52.5) v1(87.25,88.57) v1(87.25,87.81) v1(87.25,87.05) v1(87.25,86.28) v1(87.5,54.79) v1(87.5,54.03) v1(87.5,53.26) v1(87.5,52.5) v1(88.26,54.79) v1(88.26,54.03) v1(88.26,53.26) v1(88.26,52.5) v1(88.65,60.88) v1(88.65,60.12) v1(88.65,59.36) v1(88.65,58.6) v1(89.41,60.88) v1(89.41,60.12) v1(89.41,59.36) v1(89.41,58.6) v1(90.17,60.88) v1(90.17,60.12) v1(90.17,59.36) v1(90.17,58.6) v1(90.93,60.88) v1(90.93,60.12) v1(90.93,59.36) v1(90.93,58.6) v1(90.93,20.24) v1(90.93,19.48) v1(90.93,18.72) v1(90.93,17.96) v1(91.57,4.5) v1(91.57,3.73) v1(91.57,2.97) v1(91.57,2.21) v1(91.69,20.24) v1(91.69,19.48) v1(91.69,18.72) v1(91.69,17.96) v1(92.33,4.5) v1(92.33,3.73) v1(92.33,2.97) v1(92.33,2.21) v1(92.46,20.24) v1(92.46,19.48) v1(92.46,18.72) v1(92.46,17.96) v1(93.09,4.5) v1(93.09,3.73) v1(93.09,2.97) v1(93.09,2.21) v1(93.22,20.24) v1(93.22,19.48) v1(93.22,18.72) v1(93.22,17.96) v1(93.85,4.5) v1(93.85,3.73) v1(93.85,2.97) v1(93.85,2.21)
4G_RDY: length 33
  Top Layer w0.508: U1.3 1.02,54.79 1.02,71.04 4G模块.2
4G_RST: length 33.4
  Top Layer w0.508: U1.4 12.06,46.66 3.05,55.68 3.05,70.54 4G模块.3
4G_RX: length 13.9
  Top Layer w0.508: 4G模块.6 17.14,71.68 U1.35
4G_TX: length 13.9
  Top Layer w0.508: 4G模块.5 14.61,71.68 U1.36
ADC4: length 55.2
  Top Layer w0.508: 光照传感器.1 72.88,91.98 71.23,90.33 61.19,90.33 U1.29
ADC5: length 44.5
  Top Layer w0.508: U1.30 58.63,90.31 水位传感器.1
ADC7: length 35
  Top Layer w0.508: U1.32 39.12,75.87 39.12,84.63 40.1,85.62 R2.2 41.91,85.63 R1.1
BUZZER_IO: length 22.3
  Top Layer w0.508: 蜂鸣器.2 33.53,72.82 U1.33
DHT11_DATA: length 58.2
  Top Layer w0.508: v1(54.83,71.26) 60.29,71.26 v1(60.32,71.3)
  Bottom Layer w0.508: U1.24 v1(54.83,71.26) ; 温湿度传感器.2 84.89,89.28 84.67,89.28 84.25,88.86 84.25,88.64 66.91,71.3 v1(60.32,71.3)
HUMI_IO: length 55.7
  Top Layer w0.508: 加湿器.1 47.85,69.37 U1.26
I2C_SCL: length 57.4
  Top Layer w0.508: U1.14 37.47,49.33 43.43,55.3 80.01,55.3 81.28,56.57 OLED1.3
I2C_SDA: length 58
  Top Layer w0.508: OLED1.4 83.82,55.04 82.3,53.52 44.58,53.52 40,48.95 U1.15
JQ_BUSY: length 17.9
  Top Layer w0.508: U1.8 22.22,29.64 U2.2
JQ_RX: length 19.3
  Top Layer w0.508: v1(20.95,42.34) 20.95,29.13 U2.3
  Bottom Layer w0.508: v1(20.95,42.34) 17.14,46.15 U1.6
JQ_TX: length 18.2
  Top Layer w0.508: U2.4 19.69,30.4 U1.7
LED_IO: length 37
  Top Layer w0.762: LED1.1 58.35,77.33 v1(52.32,71.3)
  Bottom Layer w0.762: U1.25 v1(52.32,71.3)
MOTOR_IO: length 24.8
  Top Layer w0.508: 风扇.3 38.23,37.9 U1.11
MQ_AO: length 3.7
  Top Layer w0.508: R1.2 41.89,90.35 烟雾传感器.4
MQ_DO: length 39.6
  Top Layer w0.508: 烟雾传感器.3 44.43,78.64 U1.31
SERVO_IO: length 35.8
  Top Layer w0.508: U1.34 19.69,62.66 27.69,70.66 舵机.1
SPK+: length 24.9
  Top Layer w0.508: U2.10 2.79,3.97 U3.1
SPK-: length 25.2
  Top Layer w0.508: U3.2 5.33,4.51 U2.9
SW1: length 38.8
  Top Layer w0.508: U1.16 56.77,32.06 64.9,32.06 67.49,29.46 SW1.1 SW1.2
SW2: length 57.2
  Top Layer w0.508: U1.17 57.91,33.45 84.34,33.45 SW2.1 SW2.2
SW3: length 55.5
  Top Layer w0.508: SW3.2 SW3.1 65.95,12.72 U1.12
SW4: length 74.2
  Top Layer w0.508: SW4.2 SW4.1 82.19,19.23 61.98,19.23 U1.13
US_ECHO: length 46.8
  Top Layer w0.508: U1.10 33.91,39.67 33.91,2.21
US_TRIG: length 46.8
  Top Layer w0.508: 超声波模块.2 31.37,39.67 U1.9
WEIGHT_DT: length 9
  Top Layer w0.508: 称重模块.3 4.44,39.04 U1.1
WEIGHT_SCK: length 12.6
  Top Layer w0.508: U1.2 6.98,39.04 称重模块.2
WP_IN1: length 63
  Top Layer w0.508: U1.27 56.9,80.95 水泵.1
WP_IN2: length 66.6
  Top Layer w0.508: U1.28 56.9,83.49 水泵.2
$1N171: length 5
  Top Layer w0.762: LED1.2 80.09,77.33 R3.1

## Copper pours and planes (outline as drawn; the poured copper is in the pictures)
GND on Top Layer: -20.57,113.72 138.18,113.72 138.18,-11.51 -20.57,-11.51
GND on Bottom Layer: -56.52,140.26 181.86,140.26 181.86,-21.28 -56.52,-21.28

Small or netless copper shapes (teardrops, artwork), in the pictures only: 91 on Top Layer, 22 on Bottom Layer
